# EAGLE design nrf24prominiadapter (EAGLE 7.4.0)
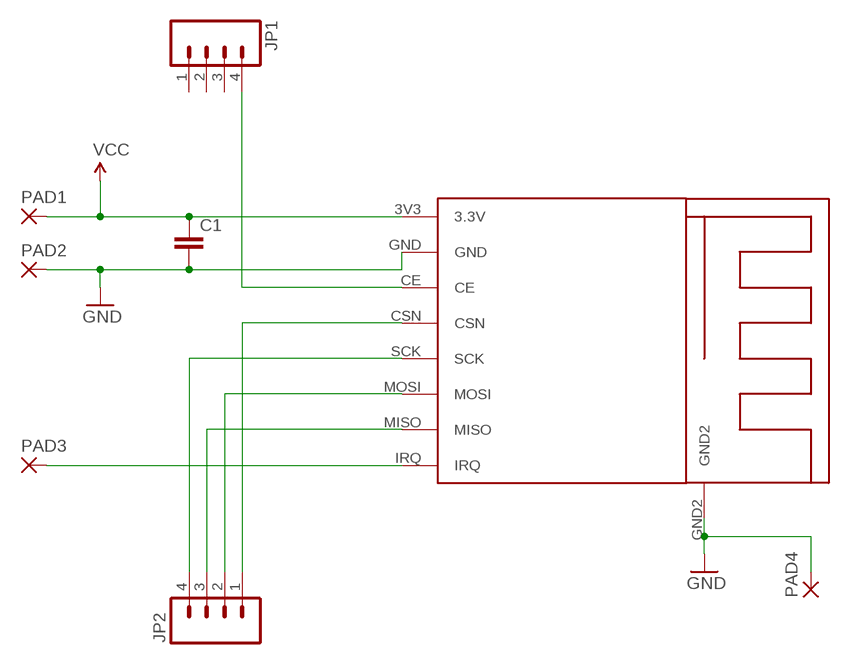
[diagram p0: schematic, sheet 1]

## Parts
C1  C-EUC0805  [C0805]
JP1  M04NO_SILK_ALL_ROUND  [1X04_NO_SILK_ALL_ROUND]
JP2  M04NO_SILK_ALL_ROUND  [1X04_NO_SILK_ALL_ROUND]
PAD1  SMD2  [SMD1,27-2,54]
PAD2  SMD2  [SMD1,27-2,54]
PAD3  SMD2  [SMD1,27-2,54]
PAD4  SMD2  [SMD1,27-2,54]
U$1  NRF24MINI  [NRF24MINI]

## Nets
GND: C1.2 PAD2.1(P) PAD4.1(P) U$1.GND U$1.GND2
N$1: JP1.4 U$1.CE
N$2: JP2.1 U$1.CSN
N$3: JP2.4 U$1.SCK
N$4: JP2.2 U$1.MOSI
N$5: JP2.3 U$1.MISO
N$6: PAD3.1(P) U$1.IRQ
VCC: C1.1 PAD1.1(P) U$1.3V3(3.3V)
Unconnected: JP1.1 JP1.2 JP1.3

## Library data of the parts
C1 = rcl:C-EU: CAPACITOR, European symbol
JP1 JP2 = SparkFun-Connectors:M04: Header 4 Standard 4-pin 0.1" header. Use with straight break away headers (SKU : PRT-00116), right angle break away headers (PRT-00553), swiss pins (PRT-00743), machine pins (PRT-00117), and female headers (PRT-00115). Molex polarized connector foot print use with SKU : PRT-08231 with associated crimp pins and housings. 1MM SMD Version SKU: PRT-10208
PAD1-PAD4 = wirepad:SMD2: SMD PAD
U$1 = nrf24mini:NRF24MINI

## Board
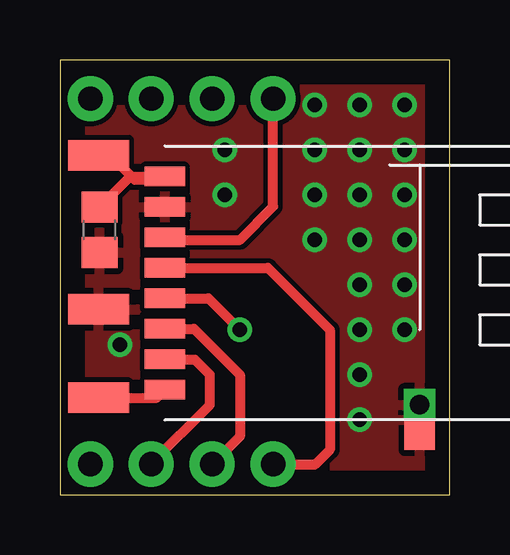
[diagram p1: board, top side]
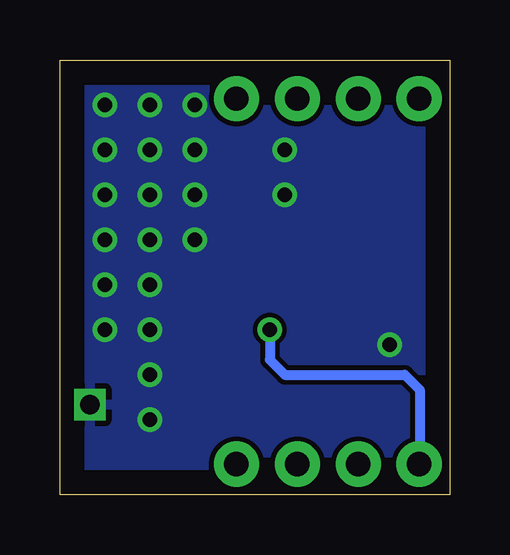
[diagram p2: board, bottom side, seen from below]

Size 16.25 x 18.12 mm. Coordinates in mm from the lower left corner, seen from the top.
Outline: 0,0 16.25,0 16.25,18.12 0,18.12 0,0
Copper layers (1*16): Top 0.035mm / dielectric 1.5mm / Bottom 0.035mm
Design rules "default *": minimum track width 10mil, minimum drill 24mil, track to track 8mil, track to pad 8mil, pad to pad 8mil, via to via 8mil, smd to smd 8mil, copper to edge 40mil, drill to drill 8mil, minimum pad ring 10mil, minimum via ring 8mil, stop-mask expansion 4mil, vias tented up to drill 24mil, thermal gap 10mil

### Footprints (pad centres in the part's own frame; a part is rotated, then mirrored left to right if it is on the bottom)
C0805 = smd 1.3 x 1.5: 1 -0.95,0; 2 0.95,0
1X04_NO_SILK_ALL_ROUND = drill 1.016 pad 1.88: 1 0,0; 2 2.54,0; 3 5.08,0; 4 7.62,0
SMD1,27-2,54 = smd 1.27 x 2.54: 1 0,0
NRF24MINI = smd 1.676 x 0.813: 3V3 0,8.89; CE 0,6.35; CSN 0,5.08; GND 0,7.62; IRQ 0,0; MISO 0,1.27; MOSI 0,2.54; SCK 0,3.81 | drill 0.8 square: GND2 10.625,-0.625

### Placement (x,y rotation side)
C1  1.65,11.04 270 top
JP1  1.27,16.51 0 top
JP2  8.89,1.27 180 top
PAD1  1.61,14.15 90 top
PAD2  15,3.12 180 top
PAD3  1.61,4.04 90 top
PAD4  1.61,7.72 90 top
U$1  4.38,4.38 0 top

### Tracks (layer width: path | path; a pad name or v marks a point on that pad's centre or on a via)
GND  (via drill 0.6)
  other vias: 6.88,12.5 2.5,6.25 14.38,16.25 12.5,16.25 14.38,14.38 14.38,12.5 14.38,10.62 14.38,8.75 14.38,6.88 10.62,16.25 10.62,14.38 12.5,14.38 12.5,12.5 10.62,12.5 10.62,10.62 12.5,10.62 12.5,8.75 12.5,6.88 12.5,5 12.5,3.12 6.88,14.38
  pour Bottom: -0.62,0 16.25,0 16.25,18.75 -0.62,18.75
  pour Top: -1.88,19.38 -1.88,-1.25 17.5,-1.25 17.5,19.38
N$1
  Top 0.406: U$1.CE 4.47,10.62 7.5,10.62 8.89,12.02 JP1.4
N$2
  Top 0.406: U$1.CSN 8.67,9.46 11.25,6.88 11.25,1.88 10.62,1.25 8.91,1.25 JP2.1
N$3  (via drill 0.6)
  Top 0.406: U$1.SCK 6.19,8.19 v7.5,6.88
  Bottom 0.406: v7.5,6.88 7.5,5.62 6.88,5 1.88,5 1.25,4.38 1.25,1.29 JP2.4
N$4
  Top 0.406: U$1.MOSI 5.58,6.92 7.5,5 7.5,2.42 JP2.2
N$5
  Top 0.406: JP2.3 3.81,1.31 6.25,3.75 6.25,5 5.62,5.62 4.39,5.62 U$1.MISO
N$6
  Top 0.406: PAD3.1 4.04,4.04 U$1.IRQ
VCC
  Top 0.406: C1.1 2.92,13.27 U$1.3V3 4.24,13.12 3.12,13.12 2.1,14.15 PAD1.1